# EAGLE schematic HealthMonitor (EAGLE 9.5.0)

## Sheet 1 of 2
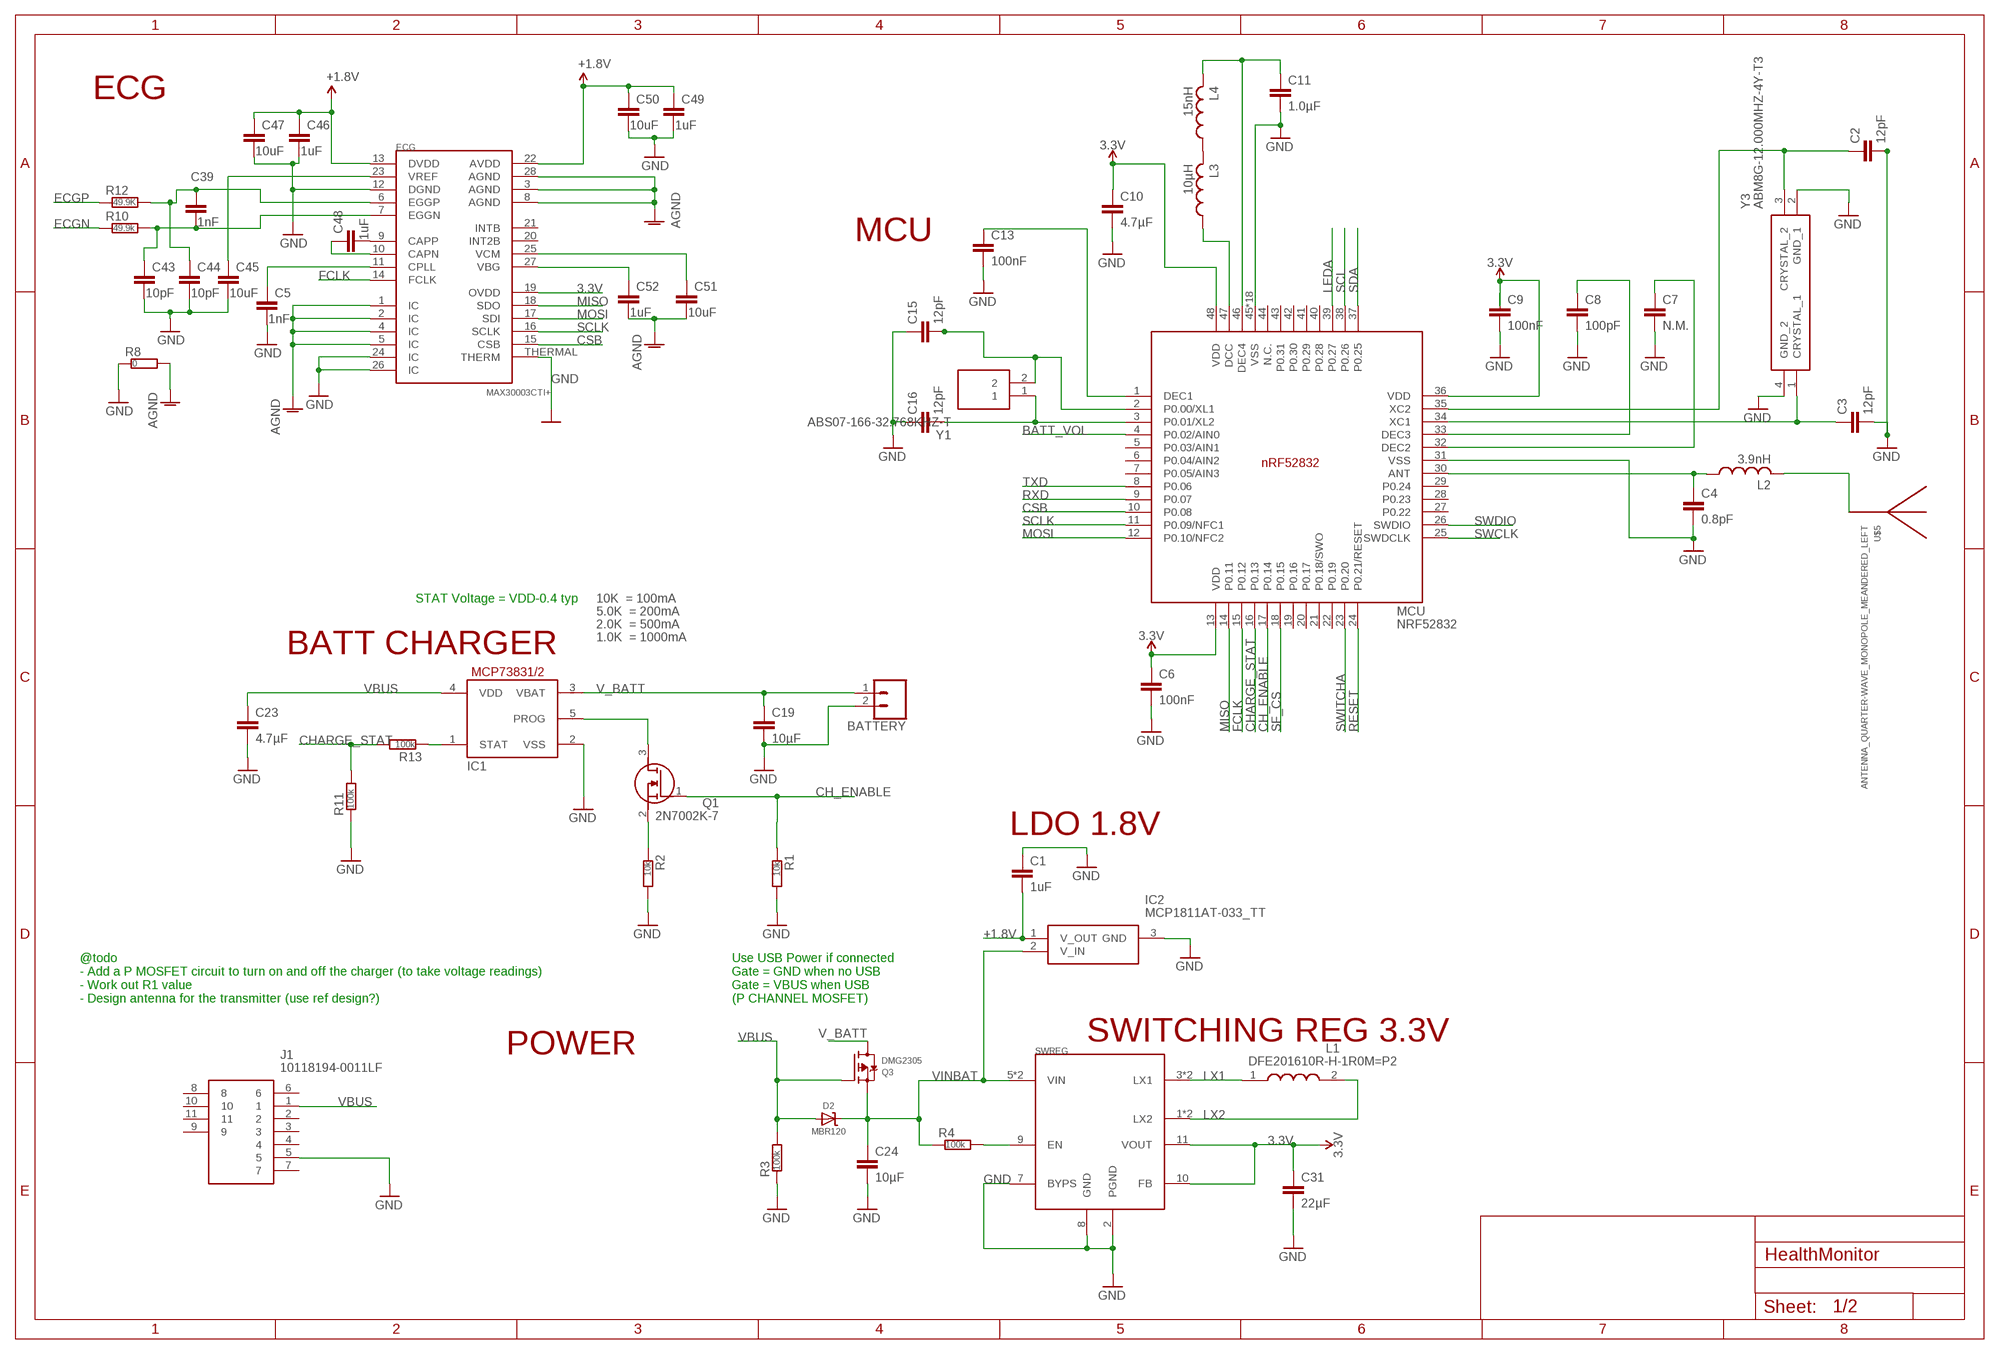
[diagram p0: schematic, sheet 1]

### Parts
BATTERY  CONN_02  [1X02]
C1  1uF  CAPACITOR_0603_N  [RESC0603_N]
C2  12pF  CAPACITOR_0603_N  [RESC0603_N]
C3  12pF  CAPACITOR_0603_N  [RESC0603_N]
C4  0.8pF  CAPACITOR_0603_N  [RESC0603_N]
C5  1nF  CAPACITOR_0603_N  [RESC0603_N]
C6  100nF  CAPACITOR_0603_N  [RESC0603_N]
C7  N.M.  CAPACITOR_0603_N  [RESC0603_N]
C8  100pF  CAPACITOR_0603_N  [RESC0603_N]
C9  100nF  CAPACITOR_0603_N  [RESC0603_N]
C10  4.7µF  CAPACITOR_0603_N  [RESC0603_N]
C11  1.0µF  CAPACITOR_0603_N  [RESC0603_N]
C13  100nF  CAPACITOR_0603_N  [RESC0603_N]
C15  12pF  CAPACITOR_0603_N  [RESC0603_N]
C16  12pF  CAPACITOR_0603_N  [RESC0603_N]
C19  10µF  CAPACITOR_0603_N  [RESC0603_N]
C23  4.7µF  CAPACITOR_0603_N  [RESC0603_N]
C24  10µF  CAPACITOR_0603_N  [RESC0603_N]
C31  22µF  CAPACITOR_0603_N  [RESC0603_N]
C39  1nF  CAPACITOR_0603_N  [RESC0603_N]
C43  10pF  CAPACITOR_0603_N  [RESC0603_N]
C44  10pF  CAPACITOR_0603_N  [RESC0603_N]
C45  10uF  CAPACITOR_0603_N  [RESC0603_N]
C46  1uF  CAPACITOR_0603_N  [RESC0603_N]
C47  10uF  CAPACITOR_0603_N  [RESC0603_N]
C48  1uF  CAPACITOR_0603_N  [RESC0603_N]
C49  1uF  CAPACITOR_0603_N  [RESC0603_N]
C50  10uF  CAPACITOR_0603_N  [RESC0603_N]
C51  10uF  CAPACITOR_0603_N  [RESC0603_N]
C52  1uF  CAPACITOR_0603_N  [RESC0603_N]
D2  MBR120  DIODE-SCHOTTKYSOD-123  [SOD-123]
ECG  MAX30003CTI+  MAX30003  [QFN-28]
IC1  MCP73831/OT  [SOT23-5L]
IC2  MCP1811AT-033_TT  [SOT95P237X112-3N]
J1  10118194-0011LF  [101181940011LF]
L1  DFE201610R-H-1R0M=P2  [INDC2016X100N]
L2  3.9nH  INDUCTOR_0603_N  [RESC0603_N]
L3  10µH  INDUCTOR_0603_N  [RESC0603_N]
L4  15nH  INDUCTOR_0603_N  [RESC0603_N]
MCU  NRF52832  [QFN40P600X600X90-48_N]
Q1  2N7002K-7  [SOT96P240X100-3N]
Q3  DMG2305  MOSFET-P  [SOT23-R]
R1  10k  RESISTOR_0603_N  [RESC0603_N]
R2  10k  RESISTOR_0603_N  [RESC0603_N]
R3  100k  RESISTOR_0603_N  [RESC0603_N]
R4  100k  RESISTOR_0603_N  [RESC0603_N]
R8  0  RESISTOR_0603_N  [RESC0603_N]
R10  49.9k  RESISTOR_0603_N  [RESC0603_N]
R11  100k  RESISTOR_0603_N  [RESC0603_N]
R12  49.9K  RESISTOR_0603_N  [RESC0603_N]
R13  100k  RESISTOR_0603_N  [RESC0603_N]
SWREG  SL9120IRVR  [TQFN-12]
U$5  ANTENNA_QUARTER-WAVE_MONOPOLE_MEANDERED_LEFT  [QWMP_MEANDERED_LEFT_+6]
Y1  ABS07-166-32.768KHZ-T  [ABS0716632768KHZT]
Y3  ABM8G-12.000MHZ-4Y-T3  [ABM8G16000MHZB4YT]

### Nets
3.3V [power]: C6.1 C9.1 C10.1 C31.1 ECG.19(OVDD) MCU.13(VDD) MCU.36(VDD) MCU.48(VDD) SWREG.10(FB) SWREG.11(VOUT) ; also sheet 2
+1.8V [power]: C1.2 C46.1 C47.1 C49.1 C50.1 ECG.13(DVDD) ECG.22(AVDD) IC2.1(V_OUT) ; also sheet 2
AGND: C51.2 C52.2 ECG.1(IC) ECG.2(IC) ECG.3(AGND) ECG.4(IC) ECG.5(IC) ECG.8(AGND) ECG.28(AGND) R8.2
BATT_VOL: MCU.4(P0.02/AIN0) ; also sheet 2
CH_ENABLE: MCU.17(P0.14) Q1.1(G) R1.1
CHARGE_STAT: MCU.16(P0.13) R11.2 R13.2
CSB: ECG.15(CSB) MCU.10(P0.08)
ECGN: R10.1
ECGN1: C39.2 C43.1 ECG.7(EGGN) R10.2
ECGP: R12.1
ECGP1: C39.1 C44.1 ECG.6(EGGP) R12.2
FCLK: ECG.14(FCLK) MCU.15(P0.12)
GND [power]: BATTERY.2 C1.1 C2.2 C3.2 C4.2 C5.2 C6.2 C7.2 C8.2 C9.2 C10.2 C11.2 C13.2 C15.1 C16.1 C19.2 C23.2 C24.2 C31.2 C43.2 C44.2 C45.2 C46.2 C47.2 C49.2 C50.2 ECG.12(DGND) ECG.24(IC) ECG.26(IC) ECG.THERMAL(THERM) IC1.2(VSS) IC2.3(GND) J1.5 MCU.31(VSS) MCU.45(VSS) MCU.PAD(VSS) MCU.PAD@VIA01(VSS) MCU.PAD@VIA02(VSS) MCU.PAD@VIA03(VSS) MCU.PAD@VIA04(VSS) MCU.PAD@VIA05(VSS) MCU.PAD@VIA06(VSS) MCU.PAD@VIA07(VSS) MCU.PAD@VIA08(VSS) MCU.PAD@VIA09(VSS) MCU.PAD@VIA10(VSS) MCU.PAD@VIA11(VSS) MCU.PAD@VIA12(VSS) MCU.PAD@VIA13(VSS) MCU.PAD@VIA14(VSS) MCU.PAD@VIA15(VSS) MCU.PAD@VIA16(VSS) R1.2 R2.2 R3.1 R8.1 R11.1 SWREG.2(PGND) SWREG.7(BYPS) SWREG.8(GND) Y3.2(GND_1) Y3.4(GND_2) ; also sheet 2
LEDA: MCU.39(P0.27) ; also sheet 2
LX1 [power]: L1.1 SWREG.3(LX1) SWREG.4(LX1)
LX2: L1.2 SWREG.1(LX2) SWREG.12(LX2)
MISO: ECG.18(SDO) MCU.14(P0.11) ; also sheet 2
MOSI: ECG.17(SDI) MCU.12(P0.10/NFC2) ; also sheet 2
N$1: R4.2 SWREG.9(EN)
N$2: IC1.1(STAT) R13.1
N$3: Q1.2(S) R2.1
N$4: C13.1 MCU.1(DEC1)
N$7: IC1.5(PROG) Q1.3(D)
N$9: C51.1 ECG.25(VCM)
N$11: L3.2 L4.1
N$12: L3.1 MCU.47(DCC)
N$13: C16.2 MCU.3(P0.01/XL2) Y1.1
N$14: C3.1 MCU.34(XC1) Y3.1(CRYSTAL_1)
N$15: C4.1 L2.1 MCU.30(ANT)
N$16: L2.2 U$5.P$1
N$17: C5.1 ECG.11(CPLL)
N$18: C48.1 ECG.10(CAPN)
N$19: C45.1 ECG.23(VREF)
N$20: C52.1 ECG.27(VBG)
N$22: C7.1 MCU.32(DEC2)
N$23: C48.2 ECG.9(CAPP)
N$24: C11.1 L4.2 MCU.46(DEC4)
N$25: C2.1 MCU.35(XC2) Y3.3(CRYSTAL_2)
N$29: C8.1 MCU.33(DEC3)
RESET: MCU.24(P0.21/RESET) ; also sheet 2
RXD: MCU.9(P0.07) ; also sheet 2
SCL: MCU.38(P0.26) ; also sheet 2
SCLK: ECG.16(SCLK) MCU.11(P0.09/NFC1) ; also sheet 2
SDA: MCU.37(P0.25) ; also sheet 2
SF_CS: MCU.18(P0.15) ; also sheet 2
SWCLK: MCU.25(SWDCLK) ; also sheet 2
SWDIO: MCU.26(SWDIO) ; also sheet 2
SWITCHA: MCU.23(P0.20) ; also sheet 2
TXD: MCU.8(P0.06) ; also sheet 2
V_BATT [power]: BATTERY.1 C19.1 IC1.3(VBAT) Q3.3(D) ; also sheet 2
VBUS [power]: C23.1 D2.A IC1.4(VDD) J1.1 Q3.1(G) R3.2
VINBAT [power]: C24.1 D2.C IC2.2(V_IN) Q3.2(S) R4.1 SWREG.5(VIN) SWREG.6(VIN)
XL1: C15.2 MCU.2(P0.00/XL1) Y1.2
Unconnected: ECG.20(INT2B) ECG.21(INTB) J1.2 J1.3 J1.4 J1.6 J1.7 J1.8 J1.9 J1.10 J1.11 MCU.5(P0.03/AIN1) MCU.6(P0.04/AIN2) MCU.7(P0.05/AIN3) MCU.19(P0.16) MCU.20(P0.17) MCU.21(P0.18/SWO) MCU.22(P0.19) MCU.27(P0.22) MCU.28(P0.23) MCU.29(P0.24) MCU.40(P0.28) MCU.41(P0.29) MCU.42(P0.30) MCU.43(P0.31) MCU.44(N.C.)

### Notes on the sheet
- ECG
- MCU
- STAT Voltage = VDD-0.4 typ | 10K  = 100mA
- 5.0K  = 200mA
- 2.0K  = 500mA
- 1.0K  = 1000mA
- BATT CHARGER
- LDO 1.8V
- @todo 
  - Add a P MOSFET circuit to turn on and off the charger (to take voltage readings) 
  - Work out R1 value 
  - Design antenna for the transmitter (use ref design?)
- Use USB Power if connected
  Gate = GND when no USB 
  Gate = VBUS when USB 
  (P CHANNEL MOSFET)
- SWITCHING REG 3.3V
- POWER

## Sheet 2 of 2
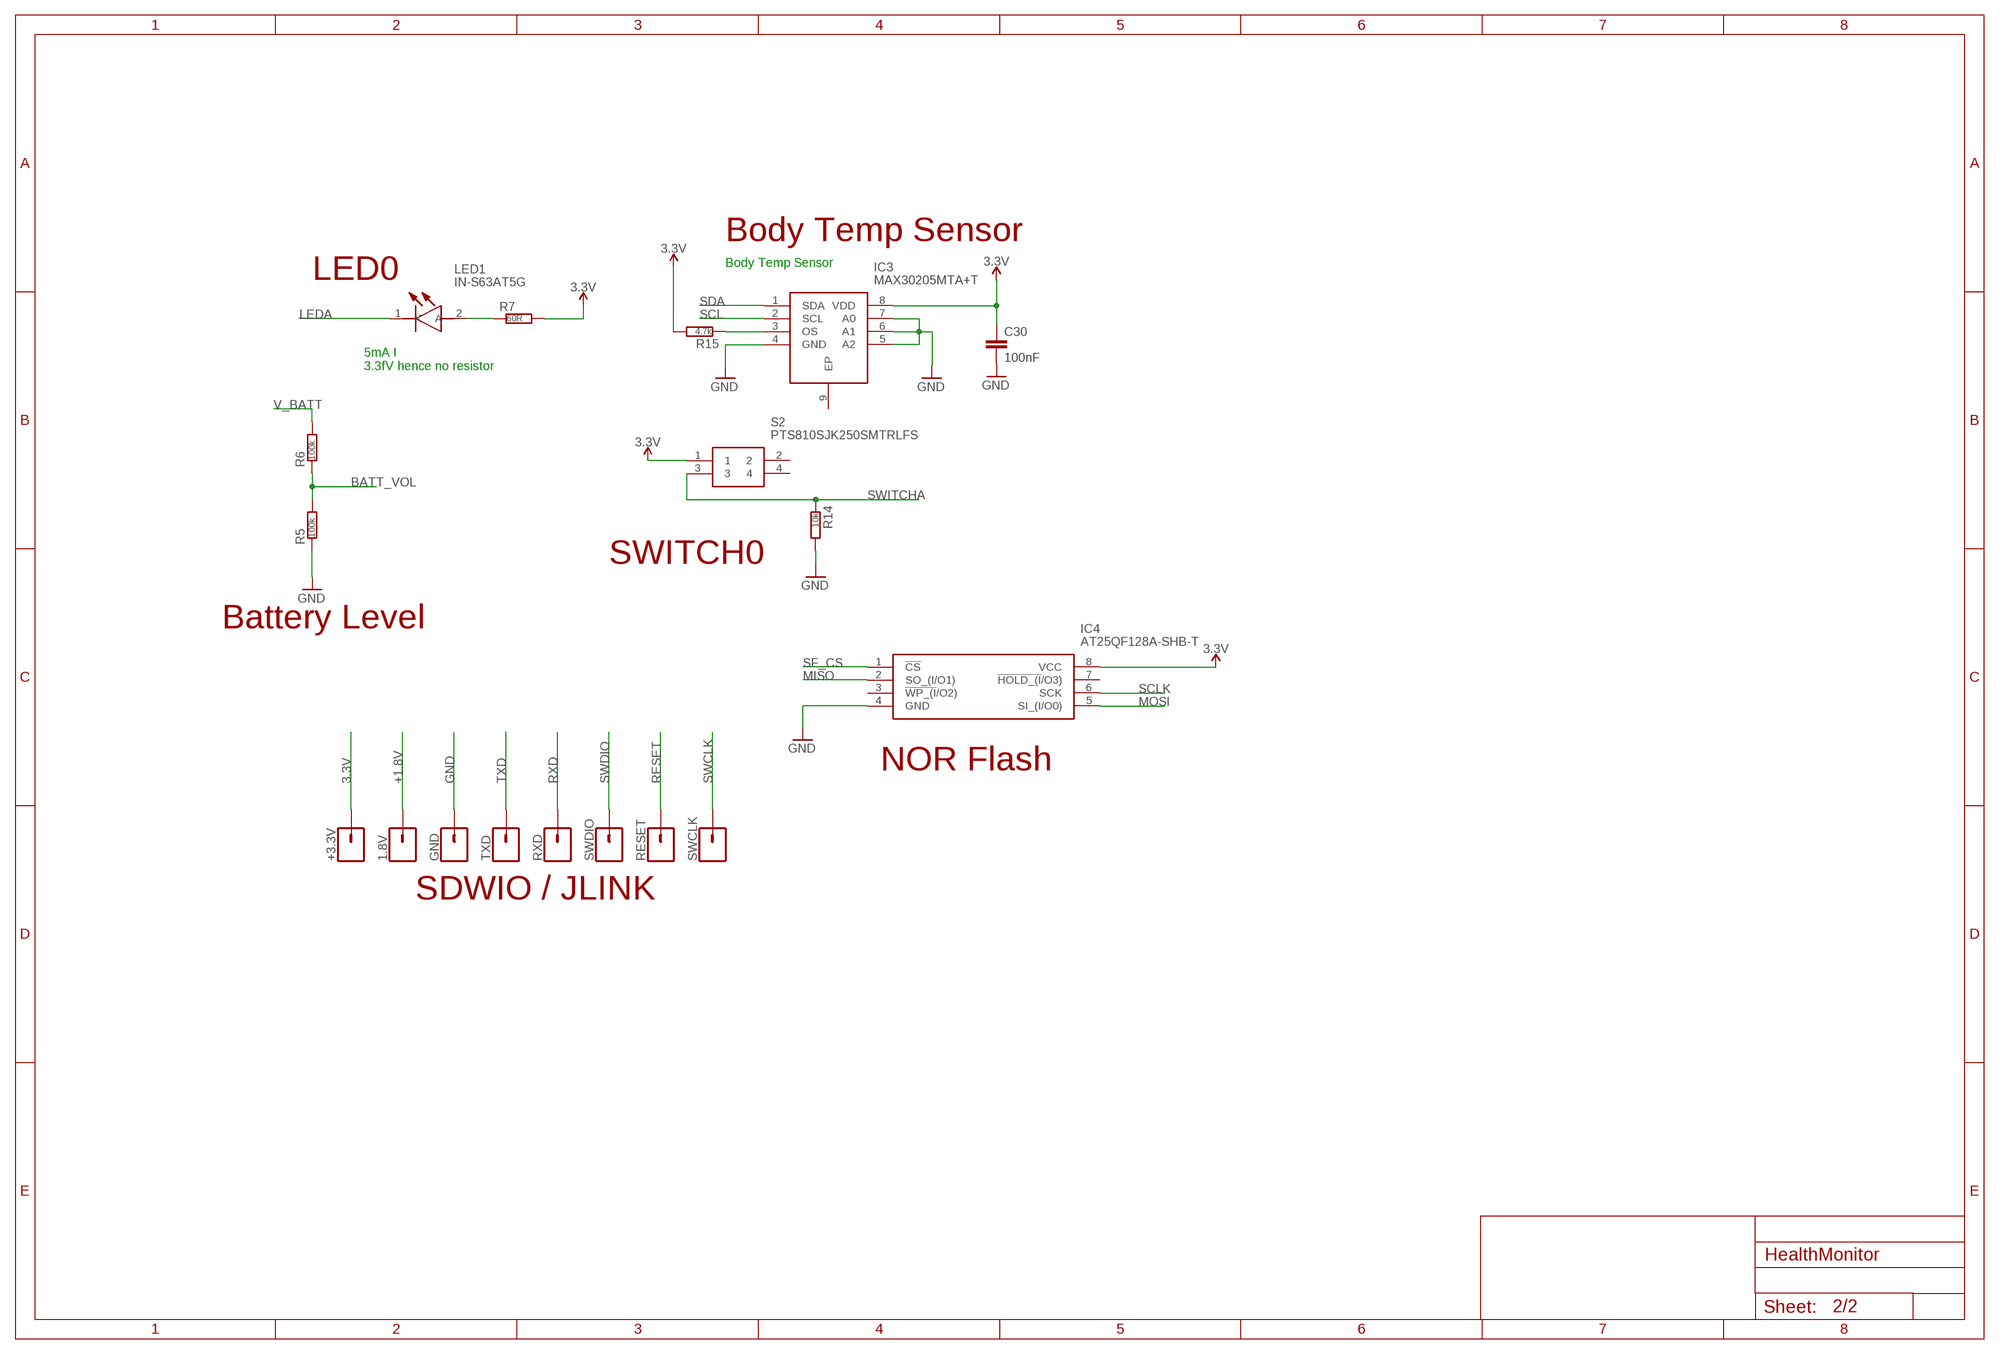
[diagram p1: schematic, sheet 2]

### Parts
1.8V  CONN_01  [1X01]
+3.3V  CONN_01  [1X01]
C30  100nF  CAPACITOR_0603_N  [RESC0603_N]
GND  CONN_01  [1X01]
IC3  MAX30205MTA+T  [SON65P300X300X80-9N]
IC4  AT25QF128A-SHB-T  [SOIC127P790X216-8N]
LED1  IN-S63AT5G  [LEDM168X39N]
R5  100k  RESISTOR_0603_N  [RESC0603_N]
R6  100k  RESISTOR_0603_N  [RESC0603_N]
R7  60R  RESISTOR_0603_N  [RESC0603_N]
R14  10k  RESISTOR_0603_N  [RESC0603_N]
R15  4.7k  RESISTOR_0603_N  [RESC0603_N]
RESET  CONN_01  [1X01]
RXD  CONN_01  [1X01]
S2  PTS810SJK250SMTRLFS  [PTS810SJG250SMTRLFS]
SWCLK  CONN_01  [1X01]
SWDIO  CONN_01  [1X01]
TXD  CONN_01  [1X01]

### Nets
3.3V [power]: +3.3V.1 C30.1 IC3.8(VDD) IC4.8(VCC) R7.2 R15.2 S2.1 ; also sheet 1
+1.8V [power]: 1.8V.1 ; also sheet 1
BATT_VOL: R5.2 R6.1 ; also sheet 1
GND [power]: C30.2 GND.1 IC3.4(GND) IC3.5(A2) IC3.6(A1) IC3.7(A0) IC4.4(GND) R5.1 R14.2 ; also sheet 1
LEDA: LED1.1(K) ; also sheet 1
MISO: IC4.2(SO_(I/O1)) ; also sheet 1
MOSI: IC4.5(SI_(I/O0)) ; also sheet 1
N$5: LED1.2(A) R7.1
N$21: IC3.3(OS) R15.1
RESET: RESET.1 ; also sheet 1
RXD: RXD.1 ; also sheet 1
SCL: IC3.2(SCL) ; also sheet 1
SCLK: IC4.6(SCK) ; also sheet 1
SDA: IC3.1(SDA) ; also sheet 1
SF_CS: IC4.1(!CS) ; also sheet 1
SWCLK: SWCLK.1 ; also sheet 1
SWDIO: SWDIO.1 ; also sheet 1
SWITCHA: R14.1 S2.3 ; also sheet 1
TXD: TXD.1 ; also sheet 1
V_BATT [power]: R6.2 ; also sheet 1
Unconnected: IC3.9(EP) IC4.3(!WP_(I!/O2)) IC4.7(!HOLD_(I!/O3)) S2.2 S2.4

### Notes on the sheet
- Body Temp Sensor
- Body Temp Sensor
- LED0
- 5mA I
  3.3fV hence no resistor
- SWITCH0
- Battery Level
- NOR Flash
- SDWIO / JLINK

## Library data of the parts
1.8V +3.3V GND RESET RXD SWCLK SWDIO TXD = SparkFun-Connectors:CONN_01: Single connection point. Often used as Generic Header-pin footprint for 0.1 inch spaced/style header connections On any of the 0.1 inch spaced packages, you can populate with these: Break Away Headers - Straight <https://www.sparkfun.com/products/116> (PRT-00116) Break Away Male Headers - Right Angle <https://www.sparkfun.com/products/553> (PRT-00553) Female Headers <https://www.sparkfun.com/products/115> (PRT-00115) Break Away Headers - Machine Pin <https://www.sparkfun.com/products/117> (PRT-00117) Break Away Female Headers - Swiss Machine Pin <https://www.sparkfun.com/products/743> (PRT-00743) This device is also useful as a general connection point to wire up your design to another part of your project. Our various solder wires solder well into these plated through hole pads. Hook-Up Wire - Assortment (Stranded, 22 AWG) <https://www.sparkfun.com/products/11375> (PRT-11375) Hook-Up Wire - Assortment (Solid Core, 22 AWG) <https://www.sparkfun.com/products/11367> (PRT-11367) View the entire wire category on our website here <https://www.sparkfun.com/categories/141> Special notes: SMTSO-256-ET is a "flush mount" nut for a 4-40 screw. We mostly use this on specialty testbeds; it is a nice way to connect hardware to your PCB at an adjustable hieght. Also note, the SNAP packages are for using a snappable style connector. We sell a baggie of snaps and they are also used on two LilyPad designs: Snap Assortment - 30 pack (male and female) <https://www.sparkfun.com/products/11347> (DEV-11347) LilyPad Arduino SimpleSnap <https://www.sparkfun.com/products/10941> (DEV-10941) LilyPad SimpleSnap Protoboard <https://www.sparkfun.com/products/10940> (DEV-10940)
BATTERY = SparkFun-Connectors:CONN_02: Multi connection point. Often used as Generic Header-pin footprint for 0.1 inch spaced/style header connections On any of the 0.1 inch spaced packages, you can populate with these: Break Away Headers - Straight <https://www.sparkfun.com/products/116> (PRT-00116) Break Away Male Headers - Right Angle <https://www.sparkfun.com/products/553> (PRT-00553) Female Headers <https://www.sparkfun.com/products/115> (PRT-00115) Break Away Headers - Machine Pin <https://www.sparkfun.com/products/117> (PRT-00117) Break Away Female Headers - Swiss Machine Pin <https://www.sparkfun.com/products/743> (PRT-00743) For SCREWTERMINALS and SPRING TERMINALS visit here: Screw Terimnals on SparkFun.com <https://www.sparkfun.com/search/results?term=Screw+Terminals> (5mm/3.5mm/2.54mm spacing) This device is also useful as a general connection point to wire up your design to another part of your project. Our various solder wires solder well into these plated through hole pads. Hook-Up Wire - Assortment (Stranded, 22 AWG) <https://www.sparkfun.com/products/11375> (PRT-11375) Hook-Up Wire - Assortment (Solid Core, 22 AWG) <https://www.sparkfun.com/products/11367> (PRT-11367) View the entire wire category on our website here <https://www.sparkfun.com/categories/141> Special notes: Molex polarized connector foot print use with: PRT-08233 with associated crimp pins and housings. 2.54_SCREWTERM for use with PRT-10571. 3.5mm Screw Terminal footprints for PRT-08084 5mm Screw Terminal footprints for use with PRT-08432
C1-C11 C13 C15 C16 C19 C23 C24 C30 C31 C39 C43-C52 = Nordic_nRF:CAPACITOR: Generic chip capacitor
D2 = microbuilder:DIODE-SCHOTTKY
ECG = circuitects:MAX30003
IC1 = adafruit:MCP73831: MCP73831/2 Miniature Single-Cell, Fully Integrated Li-Ion, Li-Polymer Charge Management Controllers. Nice and small simple lipoly charge controller, with adjustable current and status output (LED) http://www.ladyada.net/library/pcb/eaglelibrary.html
IC2 = SamacSys_Parts:MCP1811AT-033_TT: LDO Voltage Regulators Ultra Low Iq LDO Source: Datasheet <https://componentsearchengine.com/Datasheets/1/MCP1811AT-033_TT.pdf>; DESCRIPTION: LDO Voltage Regulators Ultra Low Iq LDO; HEIGHT: 1.12mm; MANUFACTURER_NAME: Microchip; MANUFACTURER_PART_NUMBER: MCP1811AT-033/TT; MOUSER_PART_NUMBER: 579-MCP1811AT-033/TT; MOUSER_PRICE-STOCK: https://www.mouser.com/Search/Refine.aspx?Keyword=579-MCP1811AT-033%2FTT
IC3 = SamacSys_Parts:MAX30205MTA+T: Human Body Temperature Sensor, 8 TDFN-EP Source: Datasheet <https://datasheets.maximintegrated.com/en/ds/MAX30205.pdf>; DESCRIPTION: Human Body Temperature Sensor, 8 TDFN-EP; HEIGHT: 0.8mm; MANUFACTURER_NAME: Maxim Integrated; MANUFACTURER_PART_NUMBER: MAX30205MTA+T; MOUSER_PART_NUMBER: 700-MAX30205MTA+T; MOUSER_PRICE-STOCK: https://www.mouser.com/Search/Refine.aspx?Keyword=700-MAX30205MTA%2BT
IC4 = SamacSys_Parts:AT25QF128A-SHB-T: NOR Flash 128Mb, 133MHz, QPI,8-SOIC-W, IND TEMP, 2.7-3.6V, T&R Source: Datasheet <https://www.adestotech.com/wp-content/uploads/AT25QF128A_Data_Sheet_RevA_03-19-2019-1.pdf>; DESCRIPTION: NOR Flash 128Mb, 133MHz, QPI,8-SOIC-W, IND TEMP, 2.7-3.6V, T&R; HEIGHT: 2.16mm; MANUFACTURER_NAME: Adesto Technologies; MANUFACTURER_PART_NUMBER: AT25QF128A-SHB-T; MOUSER_PART_NUMBER: 988-AT25QF128A-SHB-T; MOUSER_PRICE-STOCK: https://www.mouser.com/Search/Refine.aspx?Keyword=988-AT25QF128A-SHB-T
J1 = SamacSys_Parts:10118194-0011LF: Power to the Board MICRO USD B-TYPE Source: Datasheet <https://cdn.amphenol-icc.com/media/wysiwyg/files/drawing/10118194.pdf>; DESCRIPTION: Power to the Board MICRO USD B-TYPE; HEIGHT: 2mm; MANUFACTURER_NAME: Amphenol; MANUFACTURER_PART_NUMBER: 10118194-0011LF; MOUSER_PART_NUMBER: 649-10118194-0011LF; MOUSER_PRICE-STOCK: https://www.mouser.com/Search/Refine.aspx?Keyword=649-10118194-0011LF
L1 = SamacSys_Parts:DFE201610R-H-1R0M=P2: DFE201610R Series Inductor 1.0uH +/-20% 0806 (2016) Source: Datasheet <https://psearch.en.murata.com/inductor/product/DFE201610R-H-1R0M#.html>; DESCRIPTION: DFE201610R Series Inductor 1.0uH +/-20% 0806 (2016); HEIGHT: 1mm; MANUFACTURER_NAME: Murata Electronics; MANUFACTURER_PART_NUMBER: DFE201610R-H-1R0M=P2; MOUSER_PART_NUMBER: 81-DFE201610RH1R0MP2; MOUSER_PRICE-STOCK: https://www.mouser.com/Search/Refine.aspx?Keyword=81-DFE201610RH1R0MP2
L2-L4 = Nordic_nRF:INDUCTOR: Generic chip inductor
LED1 = SamacSys_Parts:IN-S63AT5G: Standard LEDs - SMD True Green LED Source: Datasheet <http://www.inolux-corp.com/datasheet/SMDLED/Mono Color Top View/IN-S63AT Series_V1.1.pdf>; DESCRIPTION: Standard LEDs - SMD True Green LED; HEIGHT: 0.39mm; MANUFACTURER_NAME: Inolux; MANUFACTURER_PART_NUMBER: IN-S63AT5G; MOUSER_PART_NUMBER: 743-IN-S63AT5G; MOUSER_PRICE-STOCK: https://www.mouser.com/Search/Refine.aspx?Keyword=743-IN-S63AT5G
MCU = Nordic_nRFMAV:NRF52832: nRF52832 Features Single chip, highly flexible, 2.4 GHz multi-protocol SoC 32-bit ARM Cortex-M4F Processor 1.7v to 3.6v operation 512kB flash + 64kB RAM Supports concurrent Bluetooth Smart/ANT protocol operation On-chip NFC tag for Out-of-Band (OOB) pairing Up to +4dBm output power -96dBm sensitivity, Bluetooth Smart Thread safe and run-time protected Event driven API On air compatible with nRF24L and nRF24AP series 2 data rates (2Mbps/1Mbps) PPI - maximum flexibility for power-efficient applications and code simplification Automated power management system with automatic power management of each peripheral Configurable I/O mapping for analog and digital I/O 3 x Master/Slave SPI 2 x Two-wire interface (I²C) UART (RTS/CTS) 3 x PWM AES HW encryption Real Time Counter (RTC) Digital microphone interface (PDM) On-chip balun Applications Internet of Things (IoT) Wearables SmartHome sensors Connected white goods Computer peripherals Voice-command smart remotes A4WP ‘Rezence’ wireless charging Beacons Sports and fitness sensors and hubs Connected health products Smart watches RC Toys Interactive games Building automation and sensor networks
Q1 = SamacSys_Parts:2N7002K-7: N-CHANNEL ENHANCEMENT MODE MOSFET Source: Datasheet <https://www.diodes.com/assets/Datasheets/ds30896.pdf>; ALLIED_NUMBER: 70437208; ALLIED_PRICE-STOCK: https://www.alliedelec.com/diodes-inc-2n7002k-7/70437208/; DESCRIPTION: N-CHANNEL ENHANCEMENT MODE MOSFET; HEIGHT: 1mm; MANUFACTURER_NAME: Diodes Inc.; MANUFACTURER_PART_NUMBER: 2N7002K-7; MOUSER_PART_NUMBER: 621-2N7002K-7; MOUSER_PRICE-STOCK: https://www.mouser.com/Search/Refine.aspx?Keyword=621-2N7002K-7; RS_PART_NUMBER: 7703383; RS_PRICE-STOCK: https://uk.rs-online.com/web/p/products/7703383
Q3 = microbuilder:MOSFET-P: P-Channel Mosfet LEGEND VDS: Voltage Drain-Source ID: Drain Current RDS(ON): Drain-Source On-State Resistance VGS(TH): Gate-Source Threshold Voltage CISS: Drain-Source Input Capacitance SOT-23 Name VDS ID RDS(ON) VGS(TH) CISS Order Number IRLML5103 30V 760mA 600 mOhm -- 75pF @ 25V Digikey: IRLML5103PBFCT-ND IRLML6401 12V 4.3A 50 mOhm 950mV @ 250µA 830pF @ 10V Digikey: IRLML6401PBFTR-ND NTR0202PL 20V 400mA 800 mOhm 2.3V @ 250uA 70pF @ 5V Digikey: NTR0202PLT1GOSTR-ND NTR4101PT1G 20V 1.8A 85 mOhm 1.2V @ 250uA 675pF @ 10V Digikey: NTR4101PT1GOSCT-ND DMP2004K 20V 600mA 900 mOhm 1V @ 250uA 175pF @ 16V Digikey: DMP2004KDICT-ND PMV65XP 20V 3.9A 76 mOhm 950mV @ 1mA 725pF @ 20V Digikey: 568-2358-2-ND TO-252 Name VDS ID RDS(ON) VGS(TH) CISS Order Number AOD417 30V 25A 34 mOhm 3V @ 250µA 920pF @ 15V Digikey: 785-1106-2-ND PowerPak Name VDS ID RDS(ON) VGS(TH) CISS Order Number AON7401 30V 12A 14 mOhm 3V @ 250µA 2600pF @ 15V Digikey: 785-1302-1-ND
R1-R8 R10-R15 = Nordic_misc:RESISTOR: Generic chip resistor
S2 = SamacSys_Parts:PTS810SJK250SMTRLFS: IP40 Black Button Tactile Switch, SPST-NO 50 mA 3mm Surface Mount Source: Datasheet <https://www.ckswitches.com/media/1476/pts810.pdf>; DESCRIPTION: IP40 Black Button Tactile Switch, SPST-NO 50 mA 3mm Surface Mount; HEIGHT: mm; MANUFACTURER_NAME: C & K COMPONENTS; MANUFACTURER_PART_NUMBER: PTS810SJK250SMTRLFS; MOUSER_PART_NUMBER: 611-PTS810SJK250SMTR; MOUSER_PRICE-STOCK: https://www.mouser.com/Search/Refine.aspx?Keyword=611-PTS810SJK250SMTR; RS_PART_NUMBER: 1359396P; RS_PRICE-STOCK: http://uk.rs-online.com/web/p/products/1359396P
SWREG = MasumAhmed:SL9120IR
U$5 = Nordic_misc:ANTENNA_QUARTER-WAVE_MONOPOLE_MEANDERED_LEFT
Y1 = SamacSys_Parts:ABS07-166-32.768KHZ-T: Crystal IOT 32.786KHz XTAL 10ppm Source: Datasheet <https://abracon.com/datasheets/ABS07-166-32.768kHz-T.pdf>; DESCRIPTION: Crystal IOT 32.786KHz XTAL 10ppm; HEIGHT: 0.9mm; MANUFACTURER_NAME: ABRACON; MANUFACTURER_PART_NUMBER: ABS07-166-32.768KHZ-T; MOUSER_PART_NUMBER: 815-ABS0716632.768KT; MOUSER_PRICE-STOCK: https://www.mouser.com/Search/Refine.aspx?Keyword=815-ABS0716632.768KT; RS_PART_NUMBER: 1753474P; RS_PRICE-STOCK: http://uk.rs-online.com/web/p/products/1753474P
Y3 = SamacSys_Parts:ABM8G-12.000MHZ-4Y-T3: Abracon 12MHz Crystal Unit +/-30ppm SMD 4-Pin 3.2 x 2.5 x 1mm Source: Datasheet <https://abracon.com/Support/PackageDrawing/Resonators/ABM8G.PDF>; ALLIED_NUMBER: 71528098; ALLIED_PRICE-STOCK: https://www.alliedelec.com/abracon-abm8g-12-000mhz-4y-t3/71528098/; DESCRIPTION: Abracon 12MHz Crystal Unit +/-30ppm SMD 4-Pin 3.2 x 2.5 x 1mm; HEIGHT: 1mm; MANUFACTURER_NAME: ABRACON; MANUFACTURER_PART_NUMBER: ABM8G-12.000MHZ-4Y-T3; MOUSER_PART_NUMBER: 815-ABM8G-12-4YT3; MOUSER_PRICE-STOCK: https://www.mouser.com/Search/Refine.aspx?Keyword=815-ABM8G-12-4YT3; RS_PART_NUMBER: 1712832P; RS_PRICE-STOCK: http://uk.rs-online.com/web/p/products/1712832P

## Net classes
1 power: width 0.178 mm